# EAGLE schematic SEG1 (EAGLE 9.6.2)
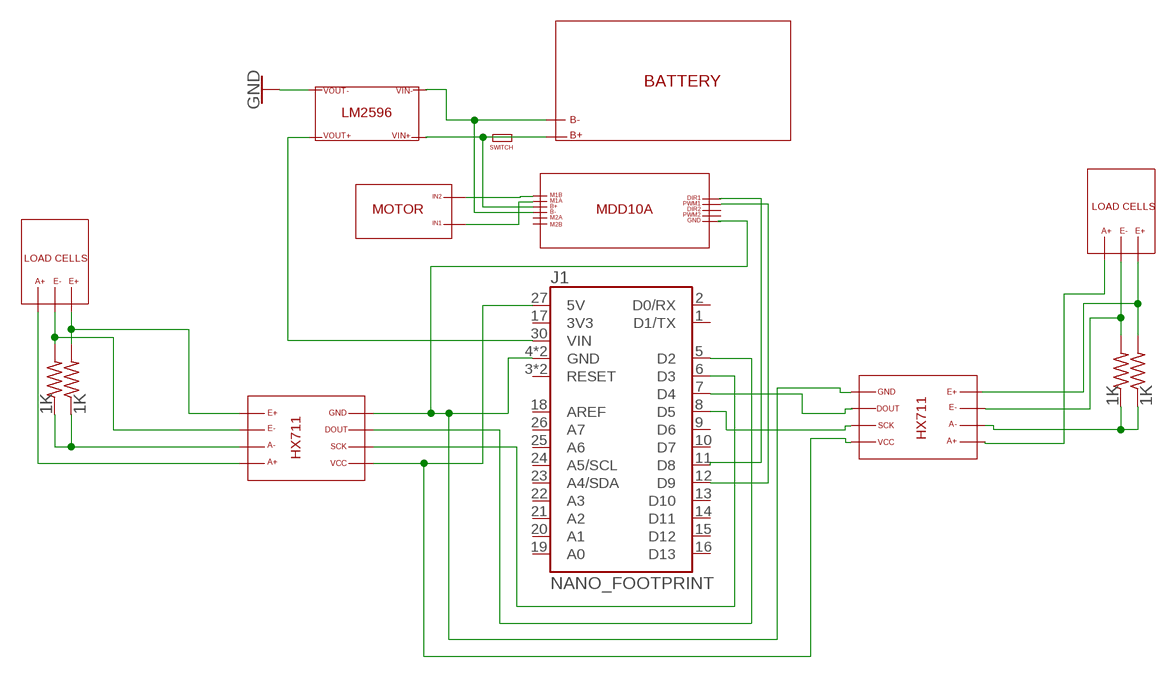
[diagram p0: schematic, sheet 1]

## Parts
J1  NANO_FOOTPRINT  [NANO]
R1  1K  R-US_0204/7  [0204/7]
R2  1K  R-US_0204/7  [0204/7]
R3  1K  R-US_0204/7  [0204/7]
R4  1K  R-US_0204/7  [0204/7]

## Nets
N$1: R2.2
N$2: R1.2
N$3: R1.1 R2.1
N$5: J1.6(D3)
N$6: J1.5(D2)
N$7: J1.8(D5)
N$8: J1.7(D4)
N$9: J1.27(5V)
N$10: J1.4(GND) J1.29(GND)
N$11: R3.2
N$12: R4.2
N$13: R3.1 R4.1
N$17: J1.12(D9)
N$18: J1.11(D8)
N$20: J1.30(VIN)
Unconnected: J1.1(D1/TX) J1.2(D0/RX) J1.3(RESET) J1.9(D6) J1.10(D7) J1.13(D10) J1.14(D11) J1.15(D12) J1.16(D13) J1.17(3V3) J1.18(AREF) J1.19(A0) J1.20(A1) J1.21(A2) J1.22(A3) J1.23(A4/SDA) J1.24(A5/SCL) J1.25(A6) J1.26(A7) J1.28(RESET)

## Notes on the sheet
- BATTERY
- VOUT- | VIN-
- LM2596
- B-
- VOUT+ | VIN+ | B+
- SWITCH
- IN2 | M1B
- DIR1
- M1A
- PWM1
- B+ | LOAD CELLS
- DIR2
- MOTOR | B- | MDD10A
- PWM2
- M2A
- GND
- IN1 | M2B
- A+ | E- | E+
- LOAD CELLS
- A+ | E- | E+
- GND | E+
- DOUT | E-
- E+ | GND
- SCK | A-
- E- | DOUT
- HX711
- VCC | A+
- A- | SCK
- HX711
- A+ | VCC

## Library data of the parts
J1 = SparkFun-Boards:NANO_FOOTPRINT: Generic Nano Footprint
R1-R4 = rcl:R-US_: RESISTOR, American symbol; SPICEPREFIX: R